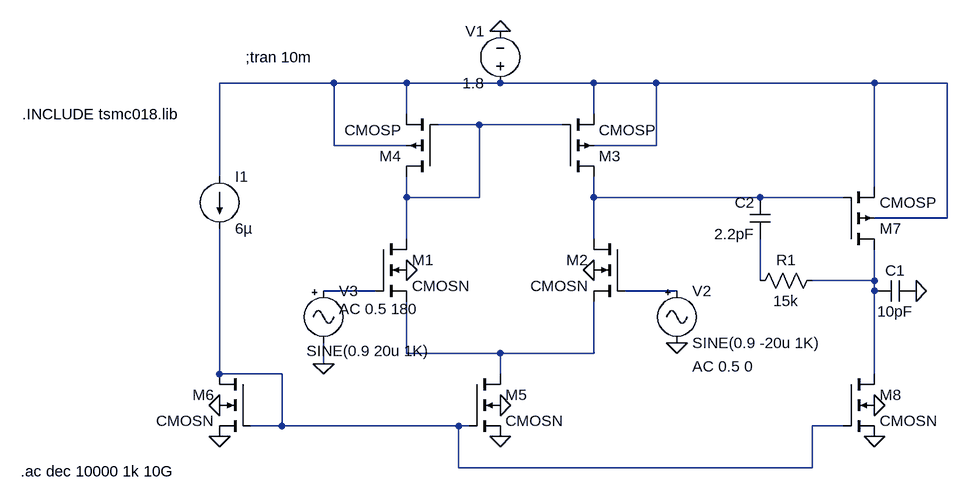
[diagram p0: schematic Open_loop_240102259.asc]
Open_loop_240102259.asc, the LTspice schematic file:
Version 4
SHEET 1 1836 1268
WIRE 384 448 208 448
WIRE 496 448 384 448
WIRE 640 448 496 448
WIRE 784 448 640 448
WIRE 880 448 784 448
WIRE 1216 448 880 448
WIRE 1328 448 1216 448
WIRE 496 496 496 448
WIRE 784 496 784 448
WIRE 608 512 544 512
WIRE 736 512 608 512
WIRE 384 544 384 448
WIRE 496 544 384 544
WIRE 880 544 880 448
WIRE 880 544 784 544
WIRE 208 592 208 448
WIRE 1216 608 1216 448
WIRE 496 624 496 592
WIRE 608 624 608 512
WIRE 608 624 496 624
WIRE 784 624 784 592
WIRE 1040 624 784 624
WIRE 1168 624 1040 624
WIRE 1328 656 1328 448
WIRE 1328 656 1216 656
WIRE 496 688 496 624
WIRE 784 688 784 624
WIRE 1040 752 1040 688
WIRE 1216 752 1216 704
WIRE 1216 752 1120 752
WIRE 448 768 368 768
WIRE 912 768 832 768
WIRE 1216 768 1216 752
WIRE 496 864 496 784
WIRE 640 864 496 864
WIRE 784 864 784 784
WIRE 784 864 640 864
WIRE 368 880 368 848
WIRE 208 896 208 672
WIRE 304 896 208 896
WIRE 640 896 640 864
WIRE 1216 896 1216 768
WIRE 304 976 304 896
WIRE 304 976 256 976
WIRE 576 976 304 976
WIRE 592 976 576 976
WIRE 1168 976 1120 976
WIRE 576 1040 576 976
WIRE 1120 1040 1120 976
WIRE 1120 1040 576 1040
FLAG 640 368 0
FLAG 496 736 0
FLAG 784 736 0
FLAG 208 944 0
FLAG 208 992 0
FLAG 640 992 0
FLAG 640 944 0
FLAG 368 880 0
FLAG 912 848 0
FLAG 1216 992 0
FLAG 1216 944 0
FLAG 1280 768 0
SYMBOL cmosn 448 688 R0
SYMATTR InstName M1
SYMATTR Value2 l=1u w=6.5u
SYMBOL cmosn 832 688 M0
SYMATTR InstName M2
SYMATTR Value2 l=1u w=6.5u
SYMBOL voltage 640 464 R180
WINDOW 0 24 96 Left 2
WINDOW 3 24 16 Left 2
WINDOW 123 0 0 Left 2
WINDOW 39 0 0 Left 2
SYMATTR InstName V1
SYMATTR Value 1.8
SYMBOL Misc\\signal 912 752 R0
WINDOW 123 24 132 Left 2
WINDOW 39 0 0 Left 2
SYMATTR Value2 AC 0.5 0
SYMATTR InstName V2
SYMATTR Value SINE(0.9 -20u 1K)
SYMBOL cmosp 736 592 M180
SYMATTR InstName M3
SYMATTR Value2 l=1u w=3.57u
SYMBOL cmosp 544 592 R180
SYMATTR InstName M4
SYMATTR Value2 l=1u w=3.57u
SYMBOL cmosn 592 896 R0
SYMATTR InstName M5
SYMATTR Value2 l=2u w=60u
SYMBOL cmosn 256 896 M0
SYMATTR InstName M6
SYMATTR Value2 l=2u w=6u
SYMBOL current 208 592 R0
WINDOW 123 0 0 Left 2
WINDOW 39 0 0 Left 2
SYMATTR InstName I1
SYMATTR Value 6µ
SYMBOL Misc\\signal 368 752 R0
WINDOW 3 -26 108 Left 2
WINDOW 123 24 44 Left 2
WINDOW 39 0 0 Left 2
SYMATTR Value SINE(0.9 20u 1K)
SYMATTR Value2 AC 0.5 180
SYMATTR InstName V3
SYMBOL cmosn 1168 896 R0
SYMATTR InstName M8
SYMATTR Value2 l=2u w=60u
SYMBOL cmosp 1168 704 M180
SYMATTR InstName M7
SYMATTR Value2 l=1u w=7.14u
SYMBOL cap 1280 752 R90
WINDOW 0 0 32 VBottom 2
WINDOW 3 32 32 VTop 2
SYMATTR InstName C1
SYMATTR Value 10pF
SYMBOL cap 1056 688 R180
WINDOW 0 24 56 Left 2
WINDOW 3 24 8 Left 2
SYMATTR InstName C2
SYMATTR Value 2.2pF
SYMBOL res 1136 736 R90
WINDOW 0 0 56 VBottom 2
WINDOW 3 32 56 VTop 2
SYMATTR InstName R1
SYMATTR Value 15k
TEXT -96 496 Left 2 !.INCLUDE tsmc018.lib
TEXT 248 408 Left 2 !;tran 10m
TEXT -98 1046 Left 2 !.ac dec 10000 1k 10G

The netlist it stands for:
* Open_loop_240102259.asc
M1 N002 N006 N008 0 CMOSN l=1u w=6.5u
M2 N003 N007 N008 0 CMOSN l=1u w=6.5u
V1 N001 0 1.8
V2 N007 0 SINE(0.9 -20u 1K) AC 0.5 0
M3 N003 N002 N001 N001 CMOSP l=1u w=3.57u
M4 N002 N002 N001 N001 CMOSP l=1u w=3.57u
M5 N008 N009 0 0 CMOSN l=2u w=60u
M6 N009 N009 0 0 CMOSN l=2u w=6u
I1 N001 N009 6µ
V3 N006 0 SINE(0.9 20u 1K) AC 0.5 180
M8 N005 N009 0 0 CMOSN l=2u w=60u
M7 N005 N003 N001 N001 CMOSP l=1u w=7.14u
C1 0 N005 10pF
C2 N004 N003 2.2pF
R1 N005 N004 15k
.model NMOS NMOS
.model PMOS PMOS
.lib standard.mos
.INCLUDE tsmc018.lib
;tran 10m
.ac dec 10000 1k 10G
.backanno
.end